# EAGLE design KidRobot V1.1 (EAGLE 9.3.0)
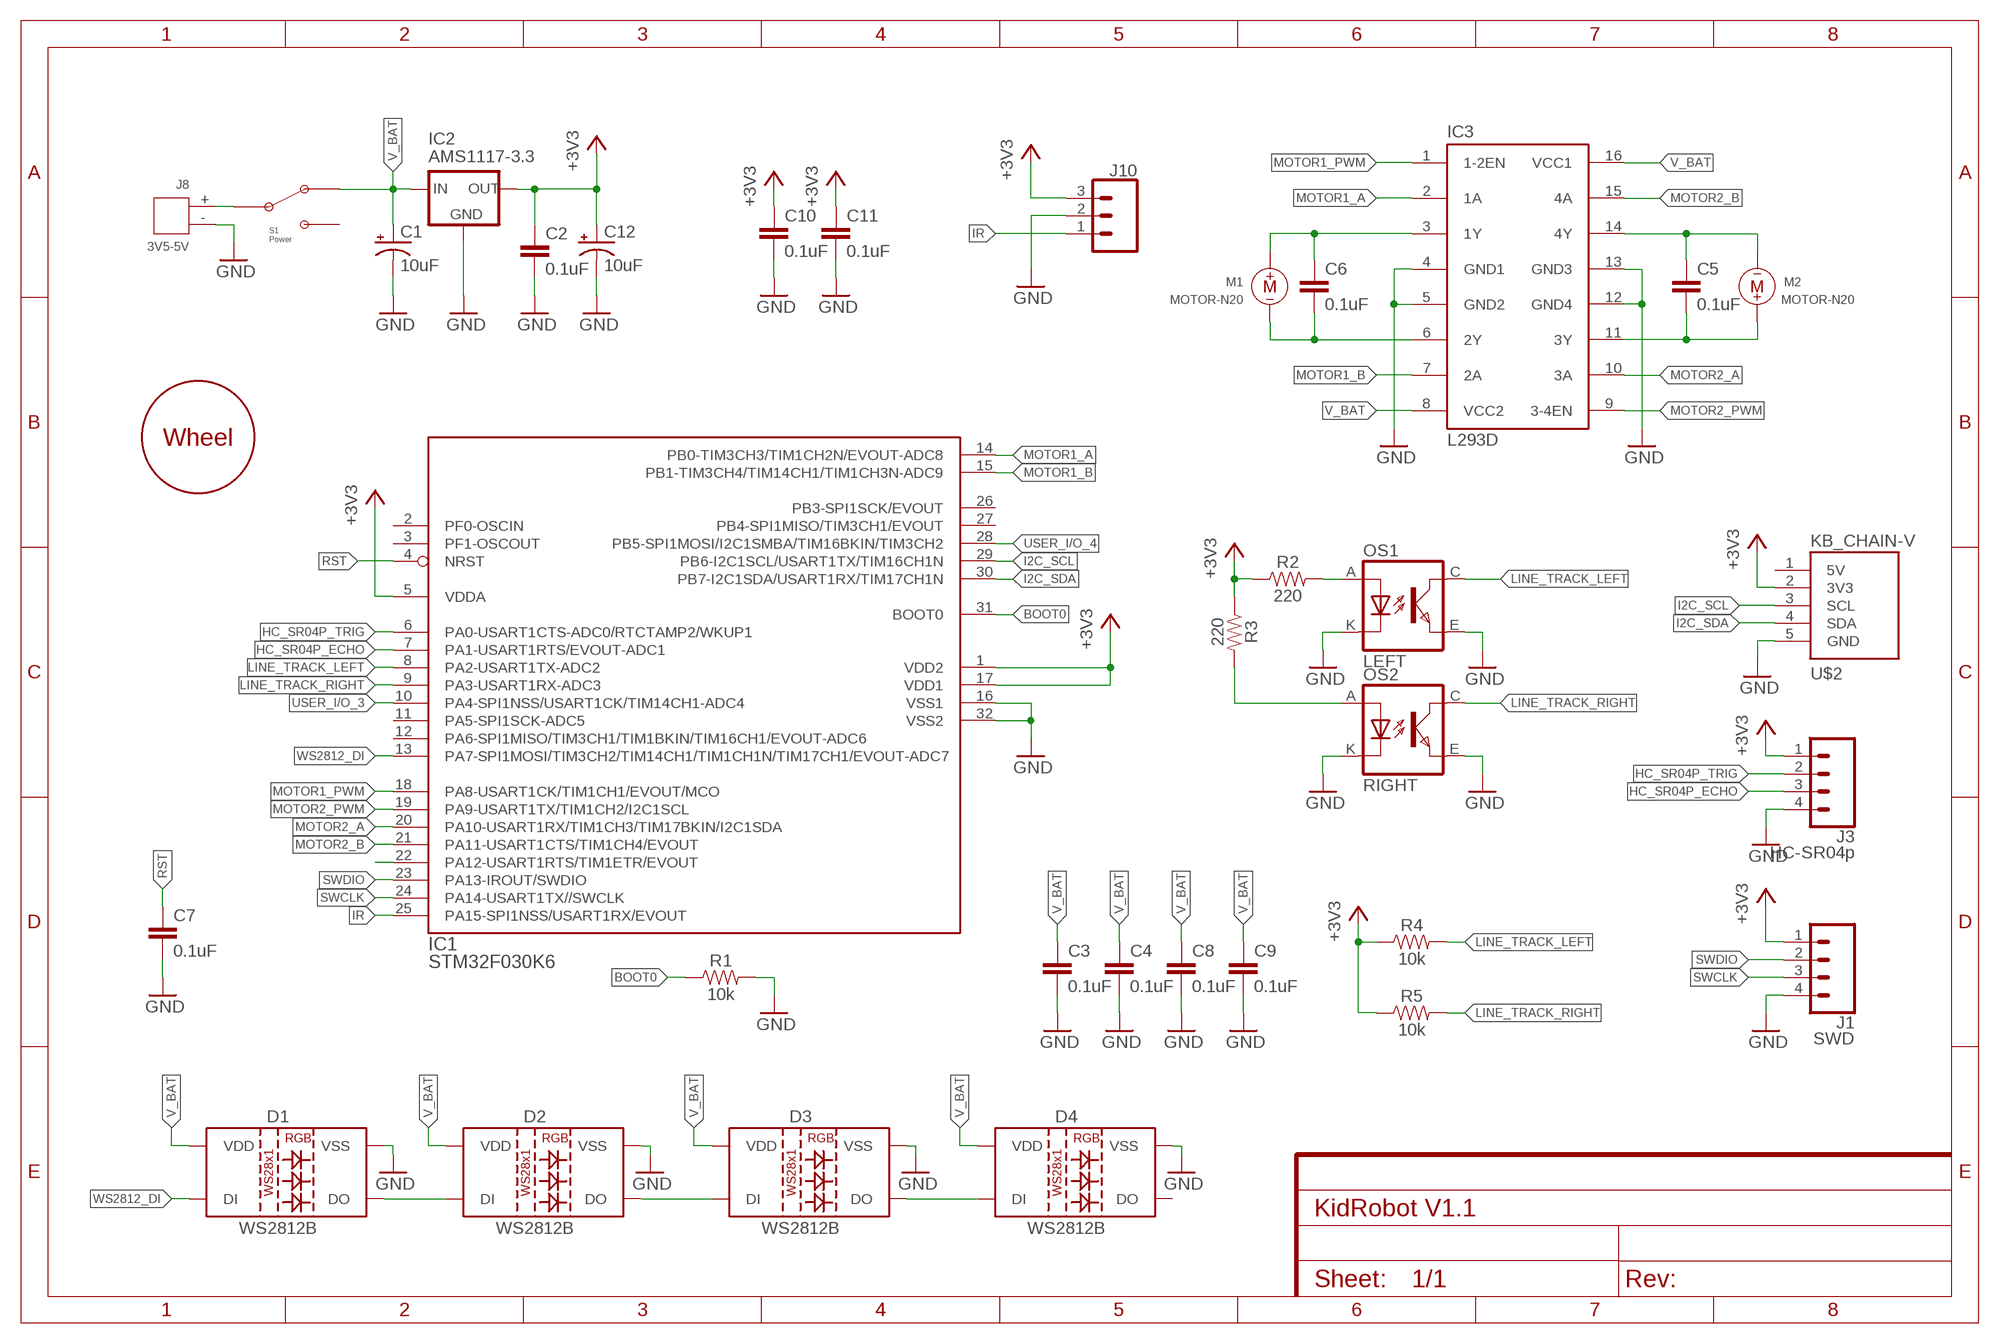
[diagram p0: schematic, sheet 1]

## Parts
C1  10uF  10UF-POLAR-RADIAL-2.5MM-25V-20%  [CPOL-RADIAL-2.5MM-5MM]
C2  0.1uF  0.1UF-0603-25V-(+80/-20%)  [0603]
C3  0.1uF  0.1UF-0603-25V-(+80/-20%)  [0603]
C4  0.1uF  0.1UF-0603-25V-(+80/-20%)  [0603]
C5  0.1uF  0.1UF-0603-25V-(+80/-20%)  [0603]
C6  0.1uF  0.1UF-0603-25V-(+80/-20%)  [0603]
C7  0.1uF  0.1UF-0603-25V-(+80/-20%)  [0603]
C8  0.1uF  0.1UF-0603-25V-(+80/-20%)  [0603]
C9  0.1uF  0.1UF-0603-25V-(+80/-20%)  [0603]
C10  0.1uF  0.1UF-0603-25V-(+80/-20%)  [0603]
C11  0.1uF  0.1UF-0603-25V-(+80/-20%)  [0603]
C12  10uF  10UF-POLAR-RADIAL-2.5MM-25V-20%  [CPOL-RADIAL-2.5MM-5MM]
D1  WS2812B  [WS2812B]
D2  WS2812B  [WS2812B]
D3  WS2812B  [WS2812B]
D4  WS2812B  [WS2812B]
IC1  STM32F030K6  [LQFP32]
IC2  AMS1117-3.3  V_REG_LD1117VXXLD1117-SMD  [SOT223]
IC3  L293D  [DIL16]
J1  SWD  CONN_04  [1X04]
J3  HC-SR04p  CONN_04  [1X04]
J8  3V5-5V  DIP-JST-2P-2.0  [H2-2.0-6X4.5MM]
J10  IR Receiver  CONN_03  [1X03]
M1  MOTOR-N20  [MOTOR-GEAR-N20]
M2  MOTOR-N20  [MOTOR-GEAR-N20]
OS1  LEFT  TCRT5000  [TCRT5000]
OS2  RIGHT  TCRT5000  [TCRT5000]
R1  10k  10KOHM-0603-1/10W-1%  [0603]
R2  220  220OHM-0603-1/10W-1%  [0603]
R3  220  220OHM-0603-1/10W-1%  [0603]
R4  10k  10KOHM-0603-1/10W-1%  [0603]
R5  10k  10KOHM-0603-1/10W-1%  [0603]
S1  Power  SLIDESWITCHES-13X5.5MM-VER  [SLIDESWITCHES-13X5.5MM]
U$1  WHEEL  [WHEEL]
U$2  KB_CHAIN-V  [JST5PIN-V]

## Nets
+3V3: C2.1 C10.1 C11.1 C12.1(+) IC1.1(VDD2) IC1.5(VDDA) IC1.17(VDD1) IC2.2(OUT) J1.1 J3.1 J10.3 R2.1 R3.1 R4.1 R5.1 U$2.2(3V3)
BOOT0: IC1.31(BOOT0) R1.1
GND: C1.2(-) C2.2 C3.2 C4.2 C7.2 C8.2 C9.2 C10.2 C11.2 C12.2(-) D1.3(VSS) D2.3(VSS) D3.3(VSS) D4.3(VSS) IC1.16(VSS1) IC1.32(VSS2) IC2.1(GND) IC3.4(GND1) IC3.5(GND2) IC3.12(GND4) IC3.13(GND3) J1.4 J3.4 J8.- J10.2 OS1.E(EMITTER) OS1.K(CATHODE) OS2.E(EMITTER) OS2.K(CATHODE) R1.2 U$2.5(GND)
HC_SR04P_ECHO: IC1.7(PA1-USART1RTS/EVOUT-ADC1) J3.3
HC_SR04P_TRIG: IC1.6(PA0-USART1CTS-ADC0/RTCTAMP2/WKUP1) J3.2
I2C_SCL: IC1.29(PB6-I2C1SCL/USART1TX/TIM16CH1N) U$2.3(SCL)
I2C_SDA: IC1.30(PB7-I2C1SDA/USART1RX/TIM17CH1N) U$2.4(SDA)
IR: IC1.25(PA15-SPI1NSS/USART1RX/EVOUT) J10.1
LINE_TRACK_LEFT: IC1.8(PA2-USART1TX-ADC2) OS1.C(COLLECTOR) R4.2
LINE_TRACK_RIGHT: IC1.9(PA3-USART1RX-ADC3) OS2.C(COLLECTOR) R5.2
MOTOR1_A: IC1.14(PB0-TIM3CH3/TIM1CH2N/EVOUT-ADC8) IC3.2(1A)
MOTOR1_B: IC1.15(PB1-TIM3CH4/TIM14CH1/TIM1CH3N-ADC9) IC3.7(2A)
MOTOR1_PWM: IC1.18(PA8-USART1CK/TIM1CH1/EVOUT/MCO) IC3.1(1-2EN)
MOTOR2_A: IC1.20(PA10-USART1RX/TIM1CH3/TIM17BKIN/I2C1SDA) IC3.10(3A)
MOTOR2_B: IC1.21(PA11-USART1CTS/TIM1CH4/EVOUT) IC3.15(4A)
MOTOR2_PWM: IC1.19(PA9-USART1TX/TIM1CH2/I2C1SCL) IC3.9(3-4EN)
N$1: D1.2(DO) D2.4(DI)
N$2: C6.1 IC3.3(1Y) M1.+
N$3: C6.2 IC3.6(2Y) M1.-
N$4: C5.1 IC3.14(4Y) M2.-
N$5: C5.2 IC3.11(3Y) M2.+
N$6: D2.2(DO) D3.4(DI)
N$7: J8.+ S1.2
N$8: OS2.A(ANODE) R3.2
N$9: OS1.A(ANODE) R2.2
N$10: D3.2(DO) D4.4(DI)
N$15: IC1.22(PA12-USART1RTS/TIM1ETR/EVOUT)
RST: C7.1 IC1.4(NRST)
SWCLK: IC1.24(PA14-USART1TX//SWCLK) J1.3
SWDIO: IC1.23(PA13-IROUT/SWDIO) J1.2
USER_I/O_3: IC1.10(PA4-SPI1NSS/USART1CK/TIM14CH1-ADC4)
USER_I/O_4: IC1.28(PB5-SPI1MOSI/I2C1SMBA/TIM16BKIN/TIM3CH2)
V_BAT: C1.1(+) C3.1 C4.1 C8.1 C9.1 D1.1(VDD) D2.1(VDD) D3.1(VDD) D4.1(VDD) IC2.3(IN) IC3.8(VCC2) IC3.16(VCC1) S1.1
WS2812_DI: D1.4(DI) IC1.13(PA7-SPI1MOSI/TIM3CH2/TIM14CH1/TIM1CH1N/TIM17CH1/EVOUT-ADC7)
Unconnected: D4.2(DO) IC1.2(PF0-OSCIN) IC1.3(PF1-OSCOUT) IC1.11(PA5-SPI1SCK-ADC5) IC1.12(PA6-SPI1MISO/TIM3CH1/TIM1BKIN/TIM16CH1/EVOUT-ADC6) IC1.26(PB3-SPI1SCK/EVOUT) IC1.27(PB4-SPI1MISO/TIM3CH1/EVOUT) S1.3 U$2.1(5V)

## Library data of the parts
C1 C12 = SparkFun-Capacitors:10UF-POLAR: 10.0µF polarized capacitors A capacitor is a passive two-terminal electrical component used to store electrical energy temporarily in an electric field.; PROD_ID: CAP-08440
C2-C11 = SparkFun-Capacitors:0.1UF: 0.1µF ceramic capacitors A capacitor is a passive two-terminal electrical component used to store electrical energy temporarily in an electric field.; PROD_ID: CAP-00810
D1-D4 = SparkFun-LED:WS2812B: WS2812B SMD addressable RGB LED 5x5mm SMD LED with built-in controller IC. Color: Red/Green/Blue mC Rating: RGB: 390, 660, 180 mcd Forward Voltage: RGB: 2.0, 3.0, 3.0 V Packages:WS2812B SparkFun Products: Blynk Board - ESP8266 <https://www.sparkfun.com/products/13794>; PROD_ID: DIO-12503
IC1 = pel_stm32:STM32F030K6
IC2 = SparkFun-IC-Power:V_REG_LD1117VXX: LD1117VXX voltage regulator. We carry the 3.3V version (COM-00526) in TO-220 package.; PROD_ID: VREG-13917
IC3 = st-microelectronics:L293D: PUSH-PULL 4 CHANNEL DRIVER; MPN: L293D; OC_FARNELL: 9589619; OC_NEWARK: 56P8249
J1 J3 = SparkFun-Connectors:CONN_04: Multi connection point. Often used as Generic Header-pin footprint for 0.1 inch spaced/style header connections On any of the 0.1 inch spaced packages, you can populate with these: Break Away Headers - Straight <https://www.sparkfun.com/products/116> (PRT-00116) Break Away Male Headers - Right Angle <https://www.sparkfun.com/products/553> (PRT-00553) Female Headers <https://www.sparkfun.com/products/115> (PRT-00115) Break Away Headers - Machine Pin <https://www.sparkfun.com/products/117> (PRT-00117) Break Away Female Headers - Swiss Machine Pin <https://www.sparkfun.com/products/743> (PRT-00743) For SCREWTERMINALS and SPRING TERMINALS visit here: Screw Terimnals on SparkFun.com <https://www.sparkfun.com/search/results?term=Screw+Terminals> (5mm/3.5mm/2.54mm spacing) This device is also useful as a general connection point to wire up your design to another part of your project. Our various solder wires solder well into these plated through hole pads. Hook-Up Wire - Assortment (Stranded, 22 AWG) <https://www.sparkfun.com/products/11375> (PRT-11375) Hook-Up Wire - Assortment (Solid Core, 22 AWG) <https://www.sparkfun.com/products/11367> (PRT-11367) View the entire wire category on our website here <https://www.sparkfun.com/categories/141> Special notes: Molex polarized connector foot print use with SKU : PRT-08231 with associated crimp pins and housings. 1MM SMD Version SKU: PRT-10208; PROD_ID: CONN-09696
J8 = OPL_Connector:DIP-JST-2P-2.0: 320110049; VALUE: 2p-2.0
J10 = SparkFun-Connectors:CONN_03: Multi connection point. Often used as Generic Header-pin footprint for 0.1 inch spaced/style header connections On any of the 0.1 inch spaced packages, you can populate with these: Break Away Headers - Straight <https://www.sparkfun.com/products/116> (PRT-00116) Break Away Male Headers - Right Angle <https://www.sparkfun.com/products/553> (PRT-00553) Female Headers <https://www.sparkfun.com/products/115> (PRT-00115) Break Away Headers - Machine Pin <https://www.sparkfun.com/products/117> (PRT-00117) Break Away Female Headers - Swiss Machine Pin <https://www.sparkfun.com/products/743> (PRT-00743) Stackable Header - 3 Pin (Female, 0.1") <https://www.sparkfun.com/products/13875> (PRT-13875) For SCREWTERMINALS and SPRING TERMINALS visit here: Screw Terimnals on SparkFun.com <https://www.sparkfun.com/search/results?term=Screw+Terminals> (5mm/3.5mm/2.54mm spacing) This device is also useful as a general connection point to wire up your design to another part of your project. Our various solder wires solder well into these plated through hole pads. Hook-Up Wire - Assortment (Stranded, 22 AWG) <https://www.sparkfun.com/products/11375> (PRT-11375) Hook-Up Wire - Assortment (Solid Core, 22 AWG) <https://www.sparkfun.com/products/11367> (PRT-11367) View the entire wire category on our website here <https://www.sparkfun.com/categories/141> Special notes: Molex polarized connector foot print use with SKU : PRT-08232 with associated crimp pins and housings.
M1 M2 = IOXhop-Motor:MOTOR-N20
OS1 OS2 = tcrt5000:TCRT5000
R1 R4 R5 = SparkFun-Resistors:10KOHM: 10kΩ resistor A resistor is a passive two-terminal electrical component that implements electrical resistance as a circuit element. Resistors act to reduce current flow, and, at the same time, act to lower voltage levels within circuits. - Wikipedia; PROD_ID: RES-00824
R2 R3 = SparkFun-Resistors:220OHM: 220Ω resistor A resistor is a passive two-terminal electrical component that implements electrical resistance as a circuit element. Resistors act to reduce current flow, and, at the same time, act to lower voltage levels within circuits. - Wikipedia; PROD_ID: RES-07861
S1 = IOXhop Switch:SLIDESWITCHES-13X5.5MM-VER
U$1 = IOXhop Wheel:WHEEL
U$2 = IOXhop Connector:KB_CHAIN

## Board
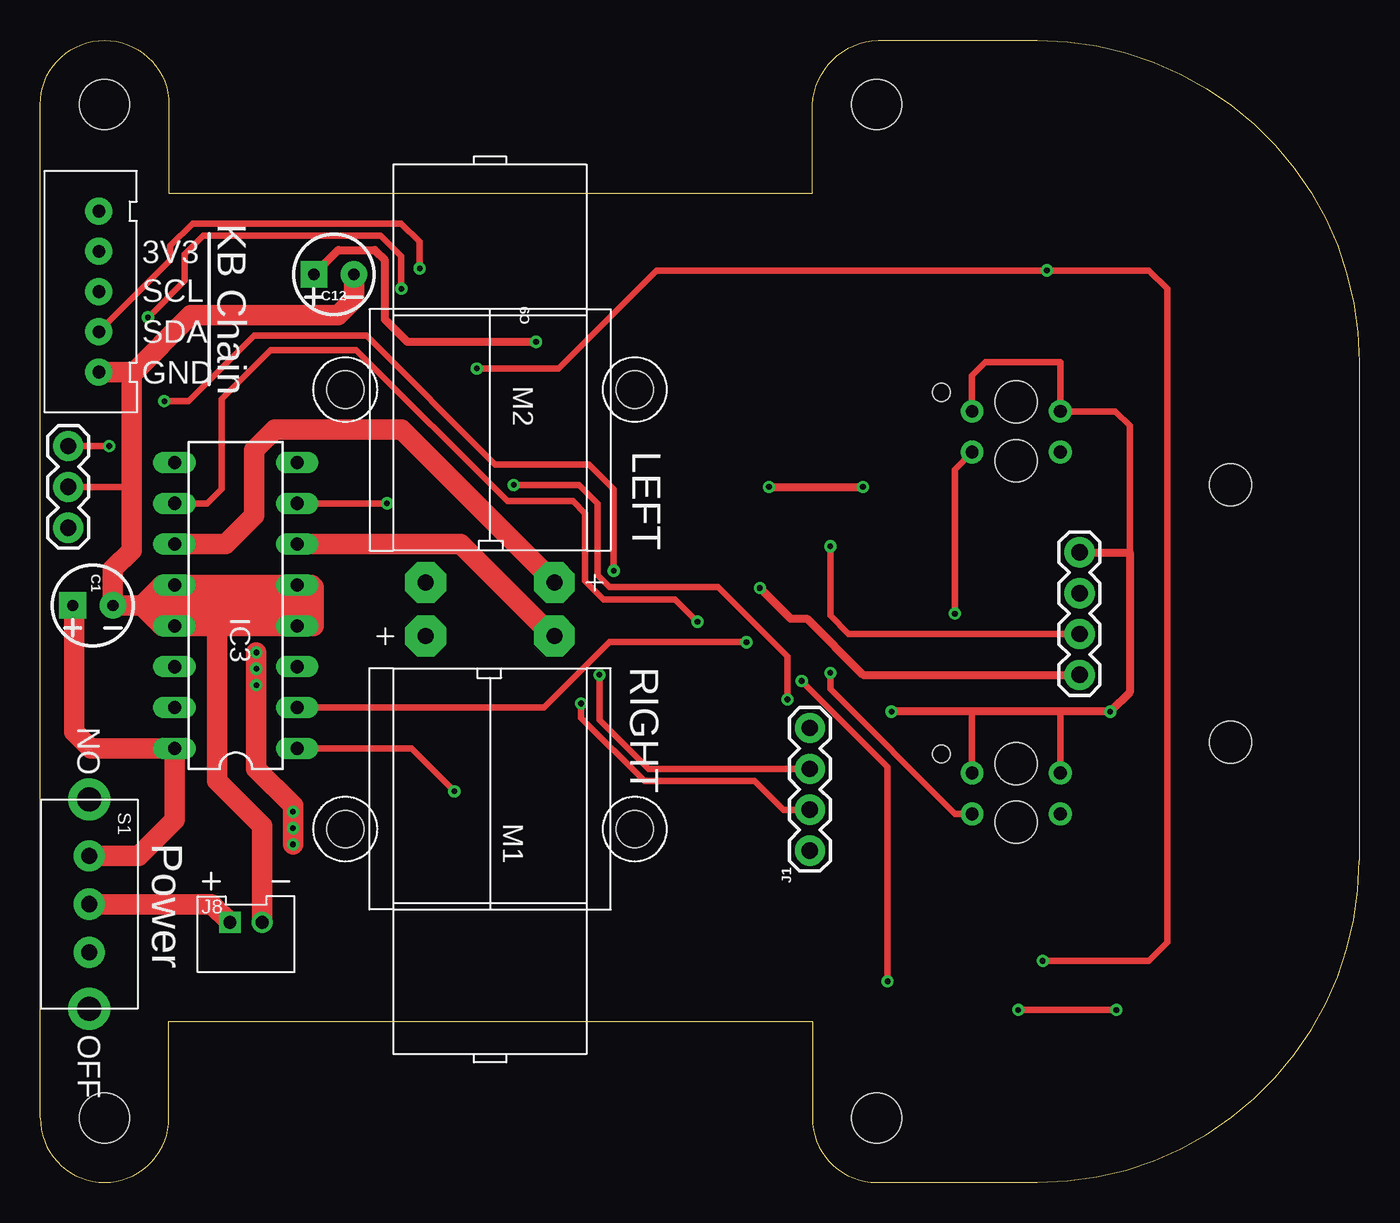
[diagram p1: board, top side]
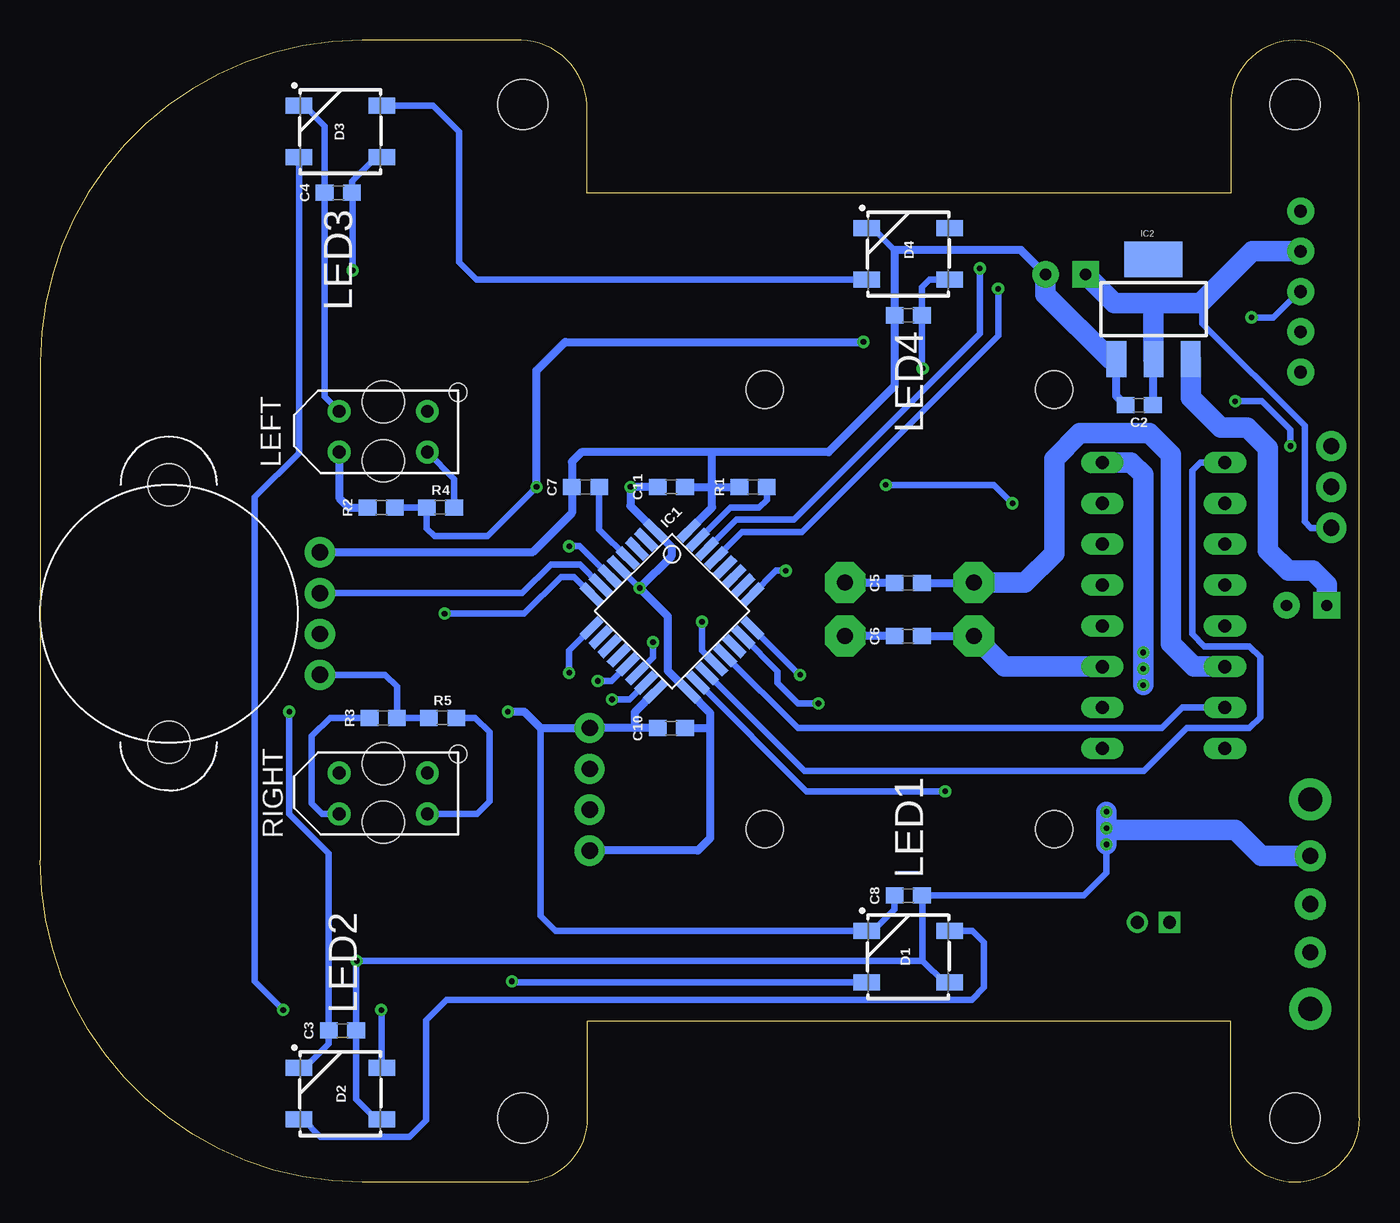
[diagram p2: board, bottom side, seen from below]

Size 82 x 71 mm. Coordinates in mm from the lower left corner, seen from the top.
Outline: 0,4 arc90 4,0 arc90 8,4 8,10 48,10 48,4 arc90 52,0 62,0 arc90 82,20 82,51 arc90 62,71 52.5,71 arc90 48,67 48,61.5 8,61.5 8,67 arc90 4,71 arc90 0,67 0,4
Copper layers (1*16): Top 0.035mm / dielectric 1.5mm / Bottom 0.035mm
Design rules "default *": minimum track width 6mil, minimum drill 0.35mm, track to track 6mil, track to pad 6mil, pad to pad 6mil, via to via 6mil, smd to smd 6mil, copper to edge 20mil, drill to drill 6mil, minimum pad ring 10mil, minimum via ring 8mil, stop-mask expansion 4mil, vias tented up to drill 20mil, thermal gap 10mil
Holes 3.1 mm at 4,67 52,67 4,4 52,4

### Footprints (pad centres in the part's own frame; a part is rotated, then mirrored left to right if it is on the bottom)
CPOL-RADIAL-2.5MM-5MM = drill 0.7 pad 1.651 square: 1 1.25,0 | drill 0.7 pad 1.651: 2 -1.25,0
0603 = smd 1.1 x 1: 1 -0.85,0; 2 0.85,0
WS2812B = smd 1.651 x 1: 1 2.577,-1.6; 2 2.577,1.6; 3 -2.577,1.6; 4 -2.577,-1.6
LQFP32 = smd 0.54 x 1.6: 1 -2.8,-4.275; 2 -2,-4.275; 3 -1.2,-4.275; 4 -0.4,-4.275; 5 0.4,-4.275; 6 1.2,-4.275; 7 2,-4.275; 8 2.8,-4.275; 17 2.8,4.275; 18 2,4.275; 19 1.2,4.275; 20 0.4,4.275; 21 -0.4,4.275; 22 -1.2,4.275; 23 -2,4.275; 24 -2.8,4.275 | smd 1.6 x 0.54: 9 4.275,-2.8; 10 4.275,-2; 11 4.275,-1.2; 12 4.275,-0.4; 13 4.275,0.4; 14 4.275,1.2; 15 4.275,2; 16 4.275,2.8; 25 -4.275,2.8; 26 -4.275,2; 27 -4.275,1.2; 28 -4.275,0.4; 29 -4.275,-0.4; 30 -4.275,-1.2; 31 -4.275,-2; 32 -4.275,-2.8
SOT223 = smd 1.219 x 2.235: 1 -2.311,-3.099; 2 0,-3.099; 3 2.311,-3.099 | smd 3.6 x 2.2: 4 0,3.099
DIL16 = drill 0.813 long: 1 -8.89,-3.81; 2 -6.35,-3.81; 3 -3.81,-3.81; 4 -1.27,-3.81; 5 1.27,-3.81; 6 3.81,-3.81; 7 6.35,-3.81; 8 8.89,-3.81; 9 8.89,3.81; 10 6.35,3.81; 11 3.81,3.81; 12 1.27,3.81; 13 -1.27,3.81; 14 -3.81,3.81; 15 -6.35,3.81; 16 -8.89,3.81
1X04 = drill 1.016 pad 1.88: 1 0,0; 2 2.54,0; 3 5.08,0; 4 7.62,0
H2-2.0-6X4.5MM = drill 0.8 pad 1.3 square: + -1,0.75 | drill 0.8 pad 1.3: - 1,0.75
1X03 = drill 1.016 pad 1.88: 1 0,0; 2 2.54,0; 3 5.08,0
MOTOR-GEAR-N20 = drill 1 pad 2.54 octagon: + 12.5,4; - 12.5,-4 | hole 2.3: 0.5,9; 0.5,-9
TCRT5000 = drill 0.8 pad 1.422: A 2.74,1.27; C -2.74,1.27; E -2.74,-1.27; K 2.74,-1.27 | hole 2.6: 0,-1.85; 0,1.8 | hole 1.1: -4.65,-2.45
SLIDESWITCHES-13X5.5MM = drill 1 pad 1.93: 1 -3,0; 2 0,0; 3 3,0 | drill 1.5 pad 2.6: NC1 -6.5,0; NC2 6.5,0
WHEEL = hole 2.6: -8,0; 8,0
JST5PIN-V = drill 0.8 pad 1.676: 1 0,0; 2 2.5,0; 3 5,0; 4 7.5,0; 5 10,0

### Placement (x,y rotation side)
C1  3.27,35.87 180 top
C2  13.68,48.31 180 bottom
C3  63.21,9.45 180 bottom
C4  63.47,61.52 180 bottom
C5  28.03,37.26 180 bottom
C6  28.03,33.96 180 bottom
C7  48.1,43.23 180 bottom
C8  28.03,17.83 180 bottom
C9  28.03,53.9 180 bottom
C10  42.77,28.25 180 bottom
C11  42.77,43.23 0 bottom
C12  18.26,56.44 180 top
D1  28.03,14.02 0 bottom
D2  63.34,5.51 0 bottom
D3  63.34,65.33 0 bottom
D4  28.03,57.71 0 bottom
IC1  42.72,35.51 225 bottom
IC2  12.79,54.28 0 bottom
IC3  12.16,35.87 90 top
J1  47.85,20.63 90 top
J3  64.61,31.55 90 top
J8  12.79,15.42 0 top
J10  1.74,45.77 270 top
M1  27.96,21.46 90 top
M2  27.96,49.78 270 top
OS1  60.67,46.66 180 bottom
OS2  60.67,24.18 180 bottom
R1  37.69,43.23 180 bottom
R2  60.8,41.96 180 bottom
R3  60.67,28.88 180 bottom
R4  57.12,41.96 0 bottom
R5  56.99,28.88 0 bottom
S1  3.05,17.3 270 top
U$1  74.01,35.36 90 top
U$2  3.65,60.38 270 top

### Tracks (layer width: path | path; a pad name or v marks a point on that pad's centre or on a via)
+3V3  (via drill 0.35)
  Top 0.508: v44.73,36.95 46.64,35.04 47.66,35.04 51.15,31.55 J3.1 | v45.31,43.23 v51.15,43.23 | v30.83,52.25 22.83,52.25 21.43,53.65 21.43,57.33 20.8,57.96 18.53,57.96 C12.1
  Bottom 0.406: v44.73,36.95 IC1.5 | J10.3 3.01,40.69 3.4,41.07 3.4,47.04 9.75,53.39 9.75,54.79 | J3.1 60.55,31.55 59.82,30.83 R3.1 R5.1 | R2.1 R4.1 57.97,40.65 57.5,40.18 54.2,40.18 v51.15,43.23
  Bottom 0.508: IC2.2 12.83,51.14 C2.1 | 40.35,28.12 40.35,29.18 IC1.17 42.98,31.8 42.98,35.19 v44.73,36.95 42.77,38.91 42.77,39.51 IC1.1 45.31,42.05 v45.31,43.23 C11.1 | 40.35,28.12 40.35,21.39 41.11,20.63 J1.1 | v51.15,43.23 51.15,50.47 49.37,52.25 v30.83,52.25 | 16.98,56.46 C12.1 | C10.1 40.48,28.25 40.35,28.12
  Bottom 1.27: IC2.2 12.79,54.66 | 12.79,54.66 15.23,54.66 C12.1 | 12.79,54.66 9.87,54.66 9.75,54.79 6.66,57.88 U$2.2
BOOT0
  Bottom 0.406: IC1.31 39.1,41.96 37.3,41.96 36.84,42.43 R1.1
GND  (via drill 0.35)
  Top 0.406: J10.2 5.68,43.23 | OS2.E 57.93,29.21 57.88,29.26 | OS2.K 63.41,29.19 63.34,29.26 | OS1.E 57.93,50.14 58.77,50.98 63.41,50.98 OS1.K 66.84,47.93 67.72,47.05 67.72,39.17
  Top 0.508: J3.4 67.72,39.17 67.72,30.47 v66.52,29.26 63.34,29.26 57.88,29.26 v52.93,29.26
  Top 1.27: IC3.12 IC3.5 | IC3.5 15.97,35.87 IC3.4 | IC3.4 IC3.13 | IC3.13 8.35,35.87 | 8.35,35.87 IC3.12 | 6.32,35.87 8.35,35.87 | IC3.12 7.59,37.14 6.32,35.87 | 6.32,35.87 7.59,34.6 IC3.13 | IC3.5 16.86,37.14 16.98,37.01 16.98,34.6 IC3.4 | J8.- 13.79,22.17 11.02,24.94 11.02,35.87 | C12.2 19.51,54.94 19.52,54.92 18.51,53.9 9.37,53.9 5.68,50.22 | C1.2 6.32,35.87 | 5.68,35.87 C1.2 | 5.68,50.22 5.68,43.23 5.68,39.3 4.52,38.13 C1.2 | 5.68,50.22 5.52,50.38 U$2.5
  Top 2.032: 8.35,35.87 11.02,35.87 | 12.03,35.87 15.97,35.87
  Bottom 0.406: D4.3 30.23,59.31 28.88,57.96 | C8.2 28.88,16.98 30.24,15.62 D1.3 49.95,15.62 50.89,16.56 50.89,28.25 | D2.3 65.55,7.11 64.06,8.6 C3.2 64.06,20.46 66.52,22.91 v66.52,29.26 | D3.3 65.58,66.93 64.32,65.67 C4.2 64.32,48.84 OS1.K
  Bottom 0.508: IC1.32 40.23,41.97 40.23,43.23 | 40.23,43.23 R1.2 | C2.2 15.11,48.88 IC2.1 | 40.23,43.23 40.23,45.39 | 40.23,45.39 48.35,45.39 48.95,44.8 C7.2 48.95,41.62 51.4,39.17 J3.4 | C11.2 40.23,43.23 | C12.2 21.03,57.96 28.88,57.96 C9.2 28.88,49.49 32.99,45.39 40.23,45.39 | C10.2 45.05,28.25 | 45.05,28.25 J1.4 50.89,28.25 51.91,29.26 v52.93,29.26 | IC1.16 45.05,29.22 45.05,28.25
  Bottom 1.27: 15.11,51.56 IC2.1 15.49,51.18 19.51,55.2 C12.2
HC_SR04P_ECHO
  Bottom 0.406: J3.3 52.04,36.63 50.26,38.41 48.45,38.41 IC1.7
HC_SR04P_TRIG  (via drill 0.35)
  Top 0.406: v49.12,39.55 49.12,35.23 50.26,34.09 J3.2
  Bottom 0.406: IC1.6 48.46,39.55 v49.12,39.55
I2C_SCL  (via drill 0.35)
  Top 0.406: v22.45,55.55 22.45,57.58 21.18,58.85 10.13,58.85 8.98,57.71 8.98,56.06 v6.7,53.77
  Bottom 0.406: IC1.29 38.36,40.44 34.64,40.44 22.45,52.63 v22.45,55.55 | U$2.3 3.73,55.38 5.33,53.77 v6.7,53.77
I2C_SDA  (via drill 0.35)
  Top 0.406: v23.59,56.82 23.59,58.47 22.45,59.62 9.49,59.62 8.1,58.22 8.1,57.33 U$2.4
  Bottom 0.406: IC1.30 38.73,41.2 35.15,41.2 23.59,52.76 v23.59,56.82
IR  (via drill 0.35)
  Top 0.406: v35.65,38.02 35.65,43.1 34.13,44.63 28.29,44.63 20.29,52.63 13.3,52.63 9.24,48.57 v7.71,48.57 | v4.29,45.77 J10.1
  Bottom 0.406: IC1.25 36.25,38.02 v35.65,38.02 | v7.71,48.57 6.06,48.57 4.29,46.79 v4.29,45.77
LINE_TRACK_LEFT  (via drill 0.35)
  Top 0.406: v56.86,35.36 56.86,44.32 OS1.C
  Bottom 0.406: IC1.8 48.82,37.64 49.62,37.64 51.91,35.36 v56.86,35.36 | R4.2 56.27,43.73 OS1.C
LINE_TRACK_RIGHT  (via drill 0.35)
  Top 0.406: v49.12,31.67 49.12,30.66 56.86,22.91 OS2.C
  Bottom 0.406: IC1.9 49.12,33.08 v49.12,31.67 | R5.2 54.96,28.88 54.07,27.99 54.07,23.67 54.83,22.91 OS2.C
MOTOR1_A  (via drill 0.35)
  Top 0.406: v43.91,33.58 35.4,33.58 31.34,29.52 IC3.2
  Bottom 0.406: IC1.14 43.91,32.63 v43.91,33.58
MOTOR1_B  (via drill 0.35)
  Top 0.406: v29.43,43.36 33.5,43.36 34.64,42.22 34.64,37.77 35.4,37.01 42.13,37.01 46.45,32.69 v46.45,30.02 | v21.56,42.22 IC3.7
  Bottom 0.406: IC1.15 45.38,30.02 v46.45,30.02 | v29.43,43.36 22.7,43.36 v21.56,42.22
MOTOR1_PWM  (via drill 0.35)
  Top 0.406: v25.75,24.31 23.08,26.98 IC3.1
  Bottom 0.406: IC1.18 34.35,24.31 v25.75,24.31
MOTOR2_A  (via drill 0.35)
  Top 0.406: v40.86,34.85 39.46,36.25 35.02,36.25 33.88,37.39 33.88,41.58 33.11,42.34 29.05,42.34 19.65,51.74 14.32,51.74 11.27,48.69 11.27,43.1 10.38,42.22 IC3.10
  Bottom 0.406: IC1.20 40.86,33.08 v40.86,34.85
MOTOR2_B
  Bottom 0.406: IC1.21 34.9,28.25 12.29,28.25 11.02,29.52 IC3.15
MOTOR2_PWM
  Bottom 0.406: IC1.19 40.55,31.63 34.5,25.58 13.4,25.58 10.73,28.25 6.83,28.25 6.17,28.91 6.17,32.67 6.83,33.33 9.62,33.33 10.38,34.09 10.38,44.25 9.87,44.76 IC3.9
N$1
  Bottom 0.406: D2.4 65.66,3.91 64.6,2.85 59.02,2.85 58.01,3.86 58.01,10.08 56.74,11.36 24.1,11.36 23.34,12.12 23.34,14.91 24.05,15.62 D1.2
N$2
  Bottom 0.508: C6.1 M1.+
  Bottom 1.27: M1.+ 22.06,32.06 IC3.3
N$3
  Top 1.27: M1.- 31.84,33.96 26.12,39.68 IC3.6
  Bottom 0.508: C6.2 M1.-
N$4
  Bottom 0.508: C5.1 23.98,37.26 M2.-
  Bottom 1.27: IC3.14 10.29,32.06 11.73,33.49 11.73,45.25 13.06,46.59 17.36,46.59 18.97,44.98 18.97,39.1 20.79,37.28 M2.-
N$5
  Top 1.27: M2.+ 22.46,46.79 14.57,46.79 13.3,45.52 13.3,41.45 11.52,39.68 IC3.11
  Bottom 0.508: C5.2 31.94,37.26 M2.+
N$6  (via drill 0.35)
  Top 0.406: v66.9,10.72 v60.8,10.72
  Bottom 0.406: D3.4 65.92,45.35 68.67,42.6 68.67,12.5 v66.9,10.72 | v60.8,10.72 60.76,10.68 D2.2
N$7
  Top 1.27: S1.2 10.67,17.3 J8.+
N$8
  Bottom 0.406: OS2.A 64.48,22.91 65.12,23.55 65.12,27.74 63.98,28.88 R3.2
N$9
  Bottom 0.508: OS1.A 63.41,42.54 62.83,41.96 R2.2
N$10
  Bottom 0.406: D4.4 54.88,56.11 55.97,57.2 55.97,65.33 57.57,66.93 D3.2
RST
  Bottom 0.406: IC1.4 47.25,40.6 C7.1
SWCLK  (via drill 0.35)
  Top 0.406: v34.77,31.55 34.77,28.75 37.81,25.71 J1.3
  Bottom 0.406: IC1.24 34.8,31.55 v34.77,31.55
SWDIO  (via drill 0.35)
  Top 0.406: v33.62,29.77 33.62,28.88 37.56,24.94 44.42,24.94 46.2,23.17 J1.2
  Bottom 0.406: IC1.23 36.16,31.77 36.16,31.04 34.89,29.77 v33.62,29.77
V_BAT  (via drill 0.35)
  Top 0.406: v27.14,50.6 32.23,50.6 38.32,56.69 v62.58,56.69 68.93,56.69 70.07,55.55 70.07,14.91 68.93,13.77 v62.32,13.77
  Top 1.27: S1.1 6.11,20.3 8.35,22.53 IC3.16 3.14,26.98 2.13,27.99 2.13,35.76 C1.1 | v15.71,21.01 v15.71,22.02 v15.71,23.04 15.71,23.42 13.43,25.71 v13.43,30.91 v13.43,31.93 v13.43,32.95
  Bottom 0.406: 27.14,13.77 25.8,12.42 D1.1 | 27.14,13.77 27.14,17.79 C8.1 17.11,17.83 15.71,19.23 v15.71,21.01 | D4.1 26.71,56.11 27.18,55.64 C9.1 27.18,50.64 v27.14,50.6 | D3.1 61.13,63.73 62.62,62.24 C4.1 62.58,61.48 v62.58,56.69 | D2.1 61.1,3.91 62.36,5.17 C3.1 62.36,13.73 v62.32,13.77 27.14,13.77
  Bottom 1.27: IC2.3 10.48,48.8 8.6,46.91 6.95,46.91 5.68,45.65 5.68,39.3 4.41,38.02 2.89,38.02 2.02,37.16 C1.1 2.02,36.14 | IC3.8 14.19,44.76 13.43,43.99 v13.43,32.95 v13.43,31.93 v13.43,30.91 | v15.71,21.01 v15.71,22.02 | v15.71,22.02 v15.71,23.04 | S1.1 6.1,20.3 7.7,21.9 15.59,21.9 v15.71,22.02
WS2812_DI  (via drill 0.35)
  Top 0.406: v47.34,31.17 52.67,25.83 v52.67,12.5
  Bottom 0.406: IC1.13 46.5,31.17 v47.34,31.17 | v52.67,12.5 52.6,12.42 D1.4

### Text on the board
tPlace: 3V3 | SCL | KB Chain | SDA | GND | LEFT | RIGHT | ON | Power | OFF
bPlace: LED3 | LED4 | LED1 | LED2
tValues: GND | ECHO | TRIG | 3V3